# Altium project pca10156.PrjPCB (part 1 of 4)
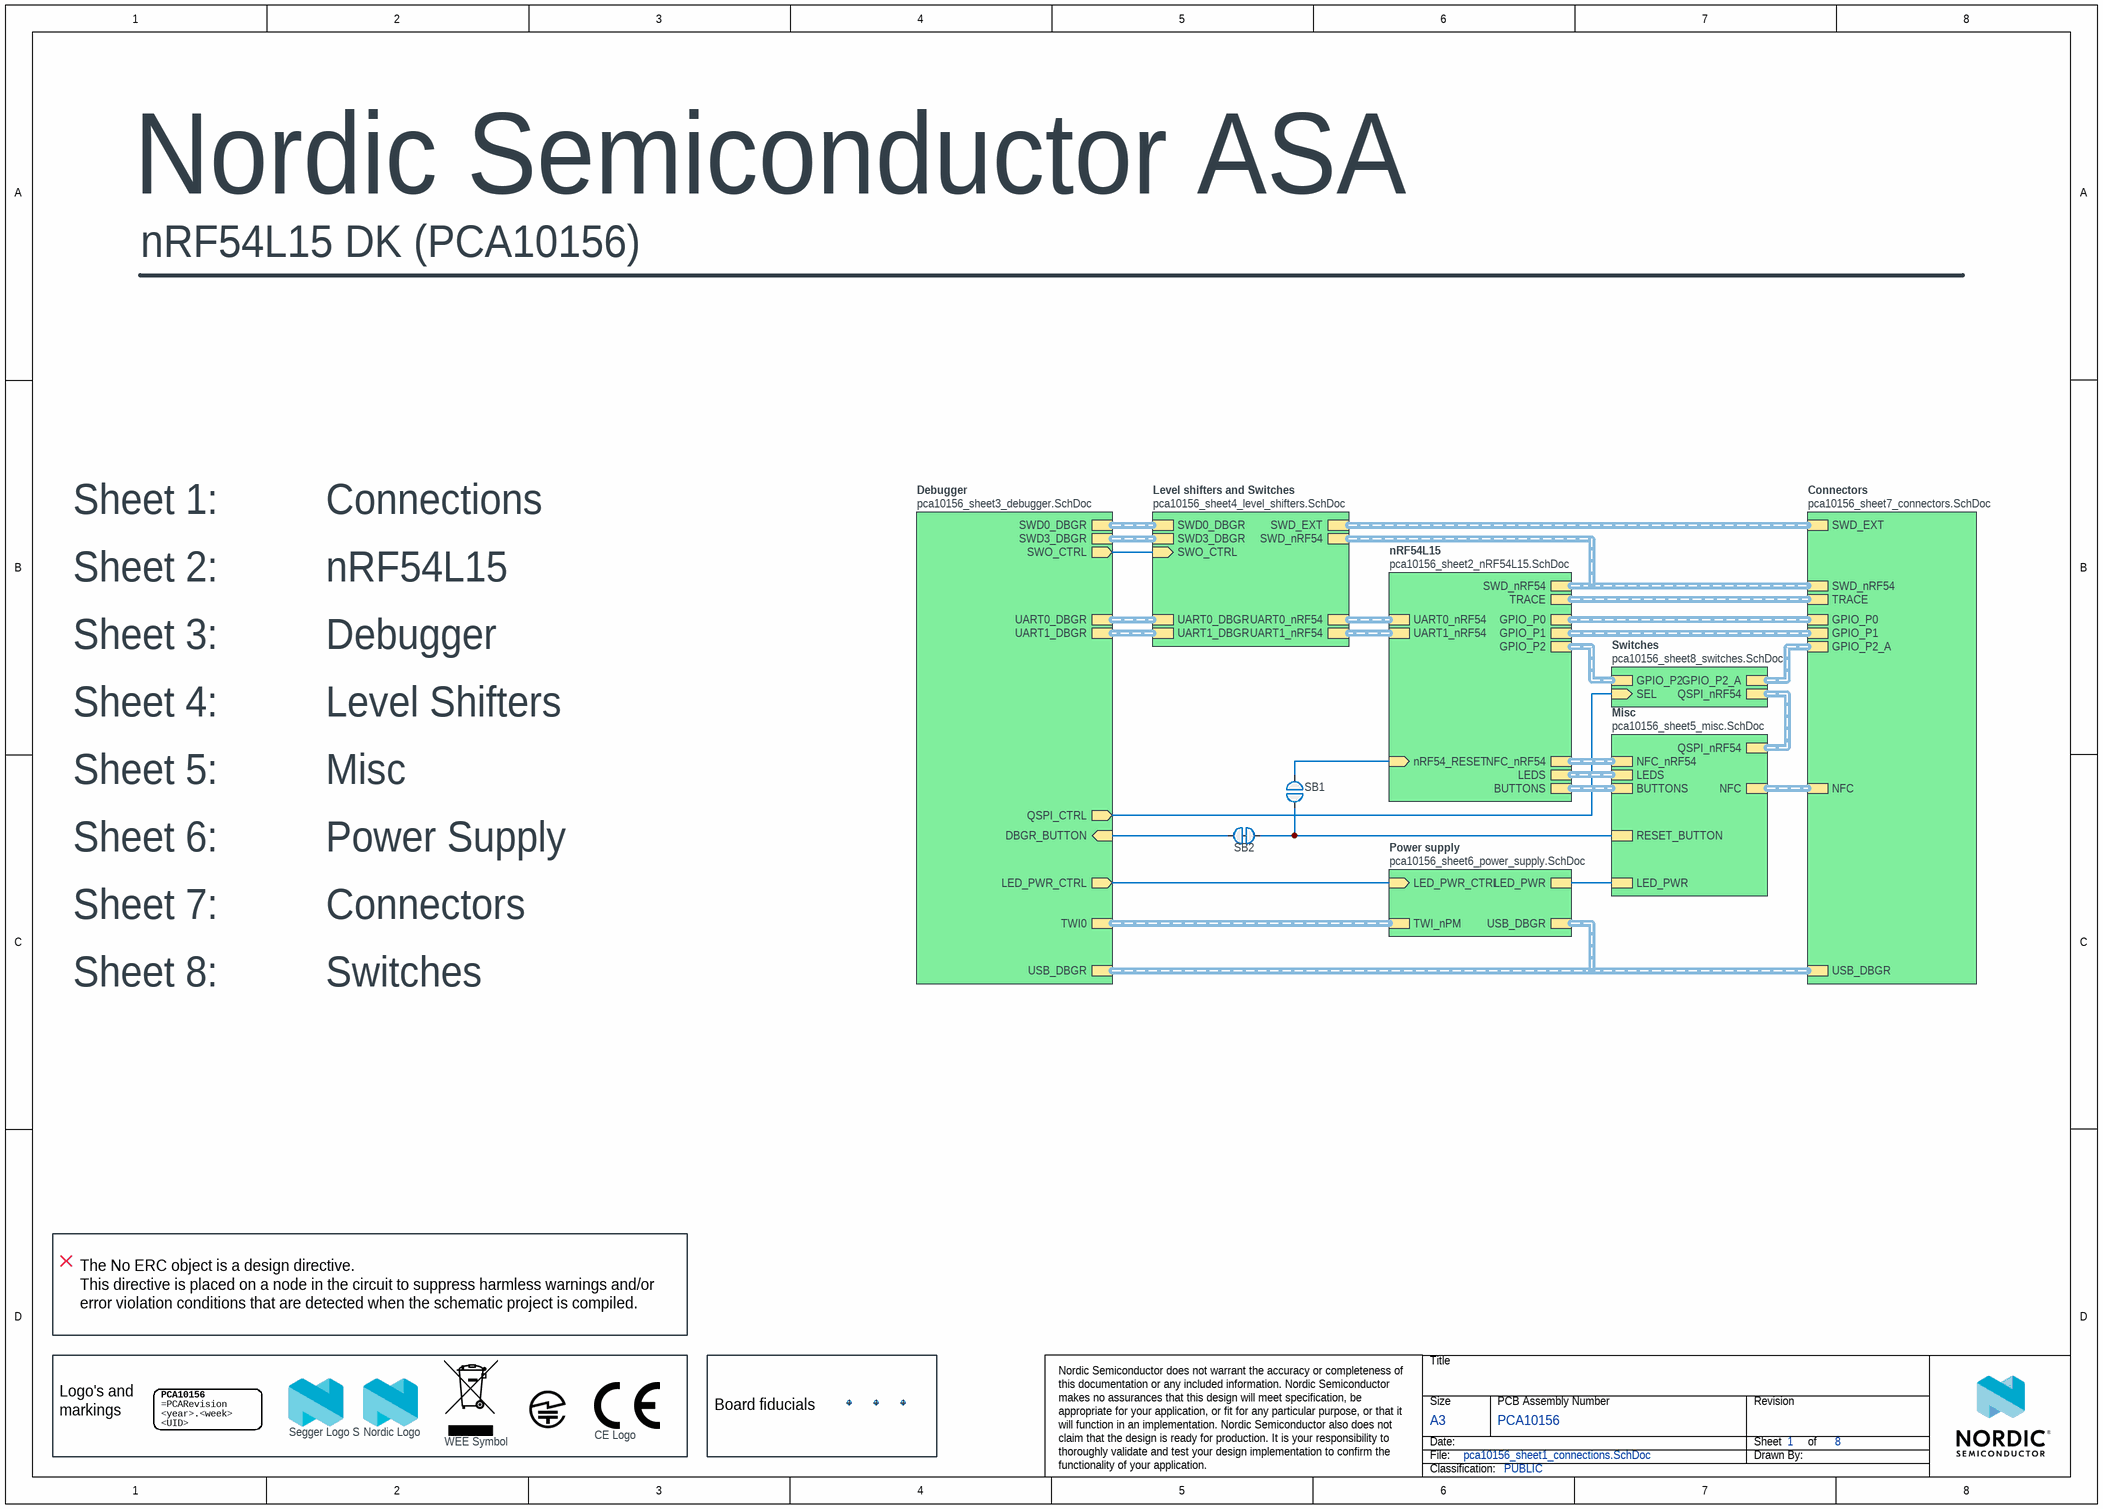
[diagram p0: pca10156_sheet1_connections.SchDoc]
BoardThickness: 1.6mm; BoardTitle: nRF54L15 DK; Classification: PUBLIC; Compliance: RoHS, REACH, Halogen-Free; Designer: STL1; Dielectric: FR-4; NrOfLayers: 4; Organization: Nordic Semiconductor; PCAName: PCA10156; PCARevision: 1.0.0; PCBNumber: 400708; PCBRevision: 0048STL1; PCBStackup: 4001; ProductName: nRF54L15 DK; SilkscreenColor: White; SoldermaskColor: Blue; SurfaceFinish: ENIG Gold
8 sheets, 226 parts. Net scope: hierarchical (ports join the sheet entries above them; power ports are global).
Board files: 400708.PcbDoc, 400708 _panel.PcbDoc
Sheets:
  pca10156_sheet1_connections.SchDoc
    nRF54L15 = pca10156_sheet2_nRF54L15.SchDoc
    Debugger = pca10156_sheet3_debugger.SchDoc
    Level shifters and Switches = pca10156_sheet4_level_shifters.SchDoc
    Misc = pca10156_sheet5_misc.SchDoc
    Power supply = pca10156_sheet6_power_supply.SchDoc
    Connectors = pca10156_sheet7_connectors.SchDoc
    Switches = pca10156_sheet8_switches.SchDoc

## Sheet pca10156_sheet1_connections.SchDoc: =BoardTitle+' - Connections'
size A3; Organization: Nordic Semiconductor; DocumentNumber: 1; Revision: 1.0.0; SheetNumber: 1; SheetTotal: 8; Author: STL1; CompanyName: Nordic Semiconductor; DrawnBy: STL1; DocumentSize: A4

### Parts
Fid1  Fiducial mark  [Fiducial]  (value not drawn)
Fid2  Fiducial mark  [Fiducial]  (value not drawn)
Fid3  Fiducial mark  [Fiducial]  (value not drawn)
LABEL1  12x12mm  [LabelSilk_12x12]  (value not drawn)
LOGO1  Nordic Logo  [NORDIC_LOGO_LYING]  (no BOM)
LOGO2  WEE Symbol  [WEE_3x4.5mm]  (no BOM)
LOGO3  Segger Logo S  [SEGGER_LOGO_S]  (no BOM)
LOGO4  CE Logo  [CE_logo]  (no BOM)
S1  Giteki Symbol  [Giteki]  (value not drawn)  (no BOM)
SB1  Solderbridge  [Solderbridge]  (value not drawn)  (no BOM)
SB2  Solderbridge  [Solderbridge_Shorted]  (value not drawn)  (net tie, no BOM)

### Sub-sheets
Connectors = pca10156_sheet7_connectors.SchDoc: SWD_nRF54 (harness SWD), TRACE (harness TRACE), NFC (harness NFC), SWD_EXT (harness SWD), GPIO_P0 (harness GPIO_P0), GPIO_P1 (harness GPIO_P1), USB_DBGR (harness USB), GPIO_P2_A (harness GPIO_P2)
Debugger = pca10156_sheet3_debugger.SchDoc: DBGR_BUTTON (in), SWD0_DBGR (harness SWD), UART0_DBGR (harness UART_DBGR), USB_DBGR (harness USB), UART1_DBGR (harness UART_DBGR), TWI0 (harness TWI), SWD3_DBGR (harness SWD), LED_PWR_CTRL (out), SWO_CTRL (out), QSPI_CTRL (out)
Level shifters and Switches = pca10156_sheet4_level_shifters.SchDoc: SWD0_DBGR (harness SWD), SWD_EXT (harness SWD), UART0_nRF54 (harness UART), UART1_nRF54 (harness UART), SWD3_DBGR (harness SWD), SWD_nRF54 (harness SWD), UART0_DBGR (harness UART_DBGR), UART1_DBGR (harness UART_DBGR), SWO_CTRL (in)
Misc = pca10156_sheet5_misc.SchDoc: NFC_nRF54 (harness NFC), NFC (harness NFC), BUTTONS (harness UI), LEDS (harness UI), RESET_BUTTON, LED_PWR, QSPI_nRF54
nRF54L15 = pca10156_sheet2_nRF54L15.SchDoc: BUTTONS (harness UI), LEDS (harness UI), TRACE (harness TRACE), NFC_nRF54 (harness NFC), GPIO_P0 (harness GPIO_P0), UART0_nRF54 (harness UART), GPIO_P1 (harness GPIO_P1), GPIO_P2 (harness GPIO_P2), UART1_nRF54 (harness UART), SWD_nRF54 (harness SWD), nRF54_RESET (in)
Power supply = pca10156_sheet6_power_supply.SchDoc: TWI_nPM (harness TWI), LED_PWR_CTRL (in), LED_PWR, USB_DBGR (harness USB)
Switches = pca10156_sheet8_switches.SchDoc: SEL (in), GPIO_P2 (harness GPIO_P2), QSPI_nRF54 (harness QSPI), GPIO_P2_A (harness GPIO_P2)

### Nets
DBGR_BUTTON: SB2.2 ; sheet Debugger/DBGR_BUTTON
LED_PWR_CTRL: sheet Debugger/LED_PWR_CTRL, sheet Power supply/LED_PWR_CTRL
nRF54_RESET: SB1.1 ; sheet nRF54L15/nRF54_RESET
QSPI_CTRL: sheet Debugger/QSPI_CTRL, sheet Switches/SEL
SWO_CTRL: sheet Debugger/SWO_CTRL, sheet Level shifters and Switches/SWO_CTRL
NetC64_2: sheet Misc/LED_PWR, sheet Power supply/LED_PWR
NetSB1_2: SB1.2 SB2.1 ; sheet Misc/RESET_BUTTON

### Buses and harness runs
harness sheet Connectors/GPIO_P0 = sheet nRF54L15/GPIO_P0
harness sheet Connectors/GPIO_P1 = sheet nRF54L15/GPIO_P1
harness sheet Connectors/GPIO_P2_A = sheet Switches/GPIO_P2_A
harness sheet Connectors/NFC = sheet Misc/NFC
harness sheet Connectors/SWD_EXT = sheet Level shifters and Switches/SWD_EXT
harness sheet Connectors/SWD_nRF54 = sheet Level shifters and Switches/SWD_nRF54 = sheet nRF54L15/SWD_nRF54
harness sheet Connectors/TRACE = sheet nRF54L15/TRACE
harness sheet Connectors/USB_DBGR = sheet Debugger/USB_DBGR = sheet Power supply/USB_DBGR
harness sheet Debugger/SWD0_DBGR = sheet Level shifters and Switches/SWD0_DBGR
harness sheet Debugger/SWD3_DBGR = sheet Level shifters and Switches/SWD3_DBGR
harness sheet Debugger/TWI0 = sheet Power supply/TWI_nPM
harness sheet Debugger/UART0_DBGR = sheet Level shifters and Switches/UART0_DBGR
harness sheet Debugger/UART1_DBGR = sheet Level shifters and Switches/UART1_DBGR
harness sheet Level shifters and Switches/UART0_nRF54 = sheet nRF54L15/UART0_nRF54
harness sheet Level shifters and Switches/UART1_nRF54 = sheet nRF54L15/UART1_nRF54
harness sheet Misc/BUTTONS = sheet nRF54L15/BUTTONS
harness sheet Misc/LEDS = sheet nRF54L15/LEDS
harness sheet Misc/NFC_nRF54 = sheet nRF54L15/NFC_nRF54
harness sheet Misc/QSPI_nRF54 = sheet Switches/QSPI_nRF54
harness sheet nRF54L15/GPIO_P2 = sheet Switches/GPIO_P2

### Notes on the sheet
- Sheet 1:          Connections
- Sheet 2:          nRF54L15
- Sheet 4:          Level Shifters
- Sheet 3:          Debugger
- Sheet 5:          Misc
- Sheet 6:          Power Supply
- Sheet 7:          Connectors
- Sheet 8:          Switches
- The No ERC object is a design directive.
  This directive is placed on a node in the circuit to suppress harmless warnings and/or error violation conditions that are detected when the schematic project is compiled.
- (near LABEL1) Logo's and markings
- (near Fid1) Board fiducials
- Nordic Semiconductor ASA
- Title
- Size
- Date:
- File:
- A3
- PCB Assembly Number
- Sheet
- Drawn By:
- Revision
- of
- Nordic Semiconductor does not warrant the accuracy or completeness of this documentation or any included information. Nordic Semiconductor makes no assurances that this design will meet specification, be appropriate for your application, or fit for any particular purpose, or that it will function in an implementation. Nordic Semiconductor also does not claim that the design is ready for production. It is your responsibility to thoroughly validate and test your design implementation to confirm the functionality of your application.
  © Nordic Semiconductor — All rights reserved.
- Classification:
- (in symbol Label_12x12) <year>.<week>; <UID>

### Library data of the parts
Fid1-Fid3 = Fid-Mark: Manufacturer: N.A.; Part number NEMS: 100500073; Value: N.A.; Pad Count: 1; Component Status: Active; System: Connector; Part Number: Fid-Mark; Manufacturer Part Number: N.A.; LatestRevisionDate: 2009-12-12; Published: 2009-12-12; Note: N.A.; Artikkelnr Noca: N.A.; Footprint Doc: Fiducial; Part number IPS: N.A.; ComponentLink1URL: N.A.; ComponentLink1Description: Datasheet; ComponentLink2URL: N.A.; ComponentLink2Description: Supplier link; HelpURL: N.A.; Supplier 1: N.A.; Supplier Part Number 1: N.A.; Supplier 2: N.A.; Supplier Part Number 2: N.A.; PartId: 100500073; Component Class: Connectors; Author: rsk; Part number Norautron: N.A.
LABEL1 = Label_12x12: PCA version label, stick-on, 12x12mm; Manufacturer: Ellco Etikett; Manufacturer Part Number: A33512‐01; Part number NEMS: 101200028; Component Status: Active; Pad Count: 0; Note: N.A.; Part Number: Label_12x12; PartId: 101200028; Component Class: Mechanicals; Author: hany; ComponentLink1URL: N.A.; ComponentLink1Description: Datasheet; ComponentLink2URL: N.A.; ComponentLink2Description: Supplier link; HelpURL: N.A.; LatestRevisionDate: 2023-01-05; Published: 2023-01-05; Footprint Doc: Label; Value: 12x12mm; Supplier 1: N.A.; Supplier Part Number 1: N.A.; Supplier 2: N.A.; Supplier Part Number 2: N.A.; Artikkelnr Noca: N.A.; Part number IPS: N.A.; Part number Norautron: N.A.
LOGO1 = Nordic Logo lying: Manufacturer: N.A.; Part number NEMS: 101100001; Component Status: Active; Pad Count: 0; Part Number: Nordic Logo lying; PartId: 101100001; Component Class: Markings; Author: rsk; Manufacturer Part Number: N.A.; ComponentLink1URL: N.A.; ComponentLink1Description: Datasheet; ComponentLink2URL: N.A.; ComponentLink2Description: Supplier link; HelpURL: N.A.; LatestRevisionDate: 2017-03-20; Published: 2017-09-01; Footprint Doc: Nordic Logo; Value: Nordic Logo; Note: N.A.; Supplier 1: N.A.; Supplier Part Number 1: N.A.; Supplier 2: N.A.; Supplier Part Number 2: N.A.; Artikkelnr Noca: N.A.; Part number IPS: N.A.; Part number Norautron: N.A.
LOGO2 = WEEE Symbol 3x4.5mm: WEEE Directive symbol; Manufacturer: N.A.; Part number NEMS: 101100006; Component Status: Active; Pad Count: 0; Part Number: WEEE Symbol 3x4.5mm; PartId: 101100006; Component Class: Markings; Author: rsk; Manufacturer Part Number: N.A.; ComponentLink1URL: N.A.; ComponentLink1Description: Datasheet; ComponentLink2URL: N.A.; ComponentLink2Description: Supplier link; HelpURL: N.A.; LatestRevisionDate: 2023-03-07; Published: 2016-09-07; Footprint Doc: WEE_3x4.5mm; Value: WEE Symbol; Note: N.A.; Supplier 1: N.A.; Supplier Part Number 1: N.A.; Supplier 2: N.A.; Supplier Part Number 2: N.A.; Artikkelnr Noca: N.A.; Part number IPS: N.A.; Part number Norautron: N.A.
LOGO3 = Segger Logo S: Segger logo, small size; Manufacturer: N.A.; Part number NEMS: 101100004; Component Status: Active; Pad Count: 0; Part Number: Segger Logo S; PartId: 101100004; Component Class: Markings; Author: rsk; Manufacturer Part Number: N.A.; ComponentLink1URL: N.A.; ComponentLink1Description: Datasheet; ComponentLink2URL: N.A.; ComponentLink2Description: Supplier link; HelpURL: N.A.; LatestRevisionDate: 2016-09-07; Published: 2016-09-07; Footprint Doc: Segger Logo S; Value: Segger Logo S; Note: N.A.; Supplier 1: N.A.; Supplier Part Number 1: N.A.; Supplier 2: N.A.; Supplier Part Number 2: N.A.; Artikkelnr Noca: N.A.; Part number IPS: N.A.; Part number Norautron: N.A.
LOGO4 = CE_logo: CE (Conformité_Européenne) logo; Manufacturer: N.A.; Part number NEMS: 101100010; Component Status: Active; Pad Count: 0; Part Number: CE_logo; PartId: 101100010; Component Class: Markings; Author: daba; Manufacturer Part Number: N.A.; ComponentLink1URL: N.A.; ComponentLink1Description: Datasheet; ComponentLink2URL: N.A.; ComponentLink2Description: Supplier link; HelpURL: N.A.; LatestRevisionDate: 2024-11-26; Published: 2024-11-26; Footprint Doc: CE_logo; Value: CE Logo; Note: N.A.; Supplier 1: N.A.; Supplier Part Number 1: N.A.; Supplier 2: N.A.; Supplier Part Number 2: N.A.; Artikkelnr Noca: N.A.; Part number IPS: N.A.; Part number Norautron: N.A.
S1 = Giteki Symbol: Manufacturer: N.A.; Part number NEMS: 101100011; Component Status: Active; Pad Count: 0; Part Number: Giteki Symbol; PartId: 101100011; Component Class: Markings; Author: getr; Manufacturer Part Number: N.A.; ComponentLink1URL: N.A.; ComponentLink1Description: Datasheet; ComponentLink2URL: N.A.; ComponentLink2Description: Supplier link; HelpURL: N.A.; LatestRevisionDate: 2025-02-28; Published: 2025-02-28; Footprint Doc: Giteki Symbol; Value: Giteki Symbol; Note: N.A.; Supplier 1: N.A.; Supplier Part Number 1: N.A.; Supplier 2: N.A.; Supplier Part Number 2: N.A.; Artikkelnr Noca: N.A.; Part number IPS: N.A.; Part number Norautron: N.A.
SB1 = Solderbridge: Manufacturer: N.A.; Part number NEMS: 100500458; Pad Count: 2; Component Status: Active; System: Connector; Part Number: Solderbridge; Manufacturer Part Number: N.A.; LatestRevisionDate: 2009-12-14; Published: 2009-12-14; Value: Solderbridge; Note: N.A.; Artikkelnr Noca: N.A.; Footprint Doc: Solderbridge; Part number IPS: N.A.; ComponentLink1URL: N.A.; ComponentLink1Description: Datasheet; ComponentLink2URL: N.A.; ComponentLink2Description: Supplier link; HelpURL: N.A.; Supplier 1: N.A.; Supplier Part Number 1: N.A.; Supplier 2: N.A.; Supplier Part Number 2: N.A.; Component Class: Connectors; PartId: 100500458; Author: rsk; Part number Norautron: N.A.
SB2 = Solderbridge Shorted: Shorted Solderbridge; Manufacturer: N.A.; Part number NEMS: 100500459; Pad Count: 2; Component Status: Active; System: Connector; Part Number: Solderbridge Shorted; Manufacturer Part Number: N.A.; LatestRevisionDate: 2012-08-07; Published: 2012-08-07; Value: Solderbridge; Note: N.A.; Artikkelnr Noca: N.A.; Footprint Doc: Solderbridge_Shorted; Part number IPS: N.A.; ComponentLink1URL: N.A.; ComponentLink1Description: Datasheet; ComponentLink2URL: N.A.; ComponentLink2Description: Supplier link; HelpURL: N.A.; Supplier 1: N.A.; Supplier Part Number 1: N.A.; Supplier 2: N.A.; Supplier Part Number 2: N.A.; Component Class: Connectors; PartId: 100500459; Author: rsk; Part number Norautron: N.A.

## Sheet pca10156_sheet2_nRF54L15.SchDoc: =BoardTitle+' - nRF54L15'
size A3; Organization: Nordic Semiconductor; DocumentNumber: 2; Revision: 1.0.0; SheetNumber: 2; SheetTotal: 8; Author: STL1; CompanyName: Nordic Semiconductor; DrawnBy: STL1; DocumentSize: A4
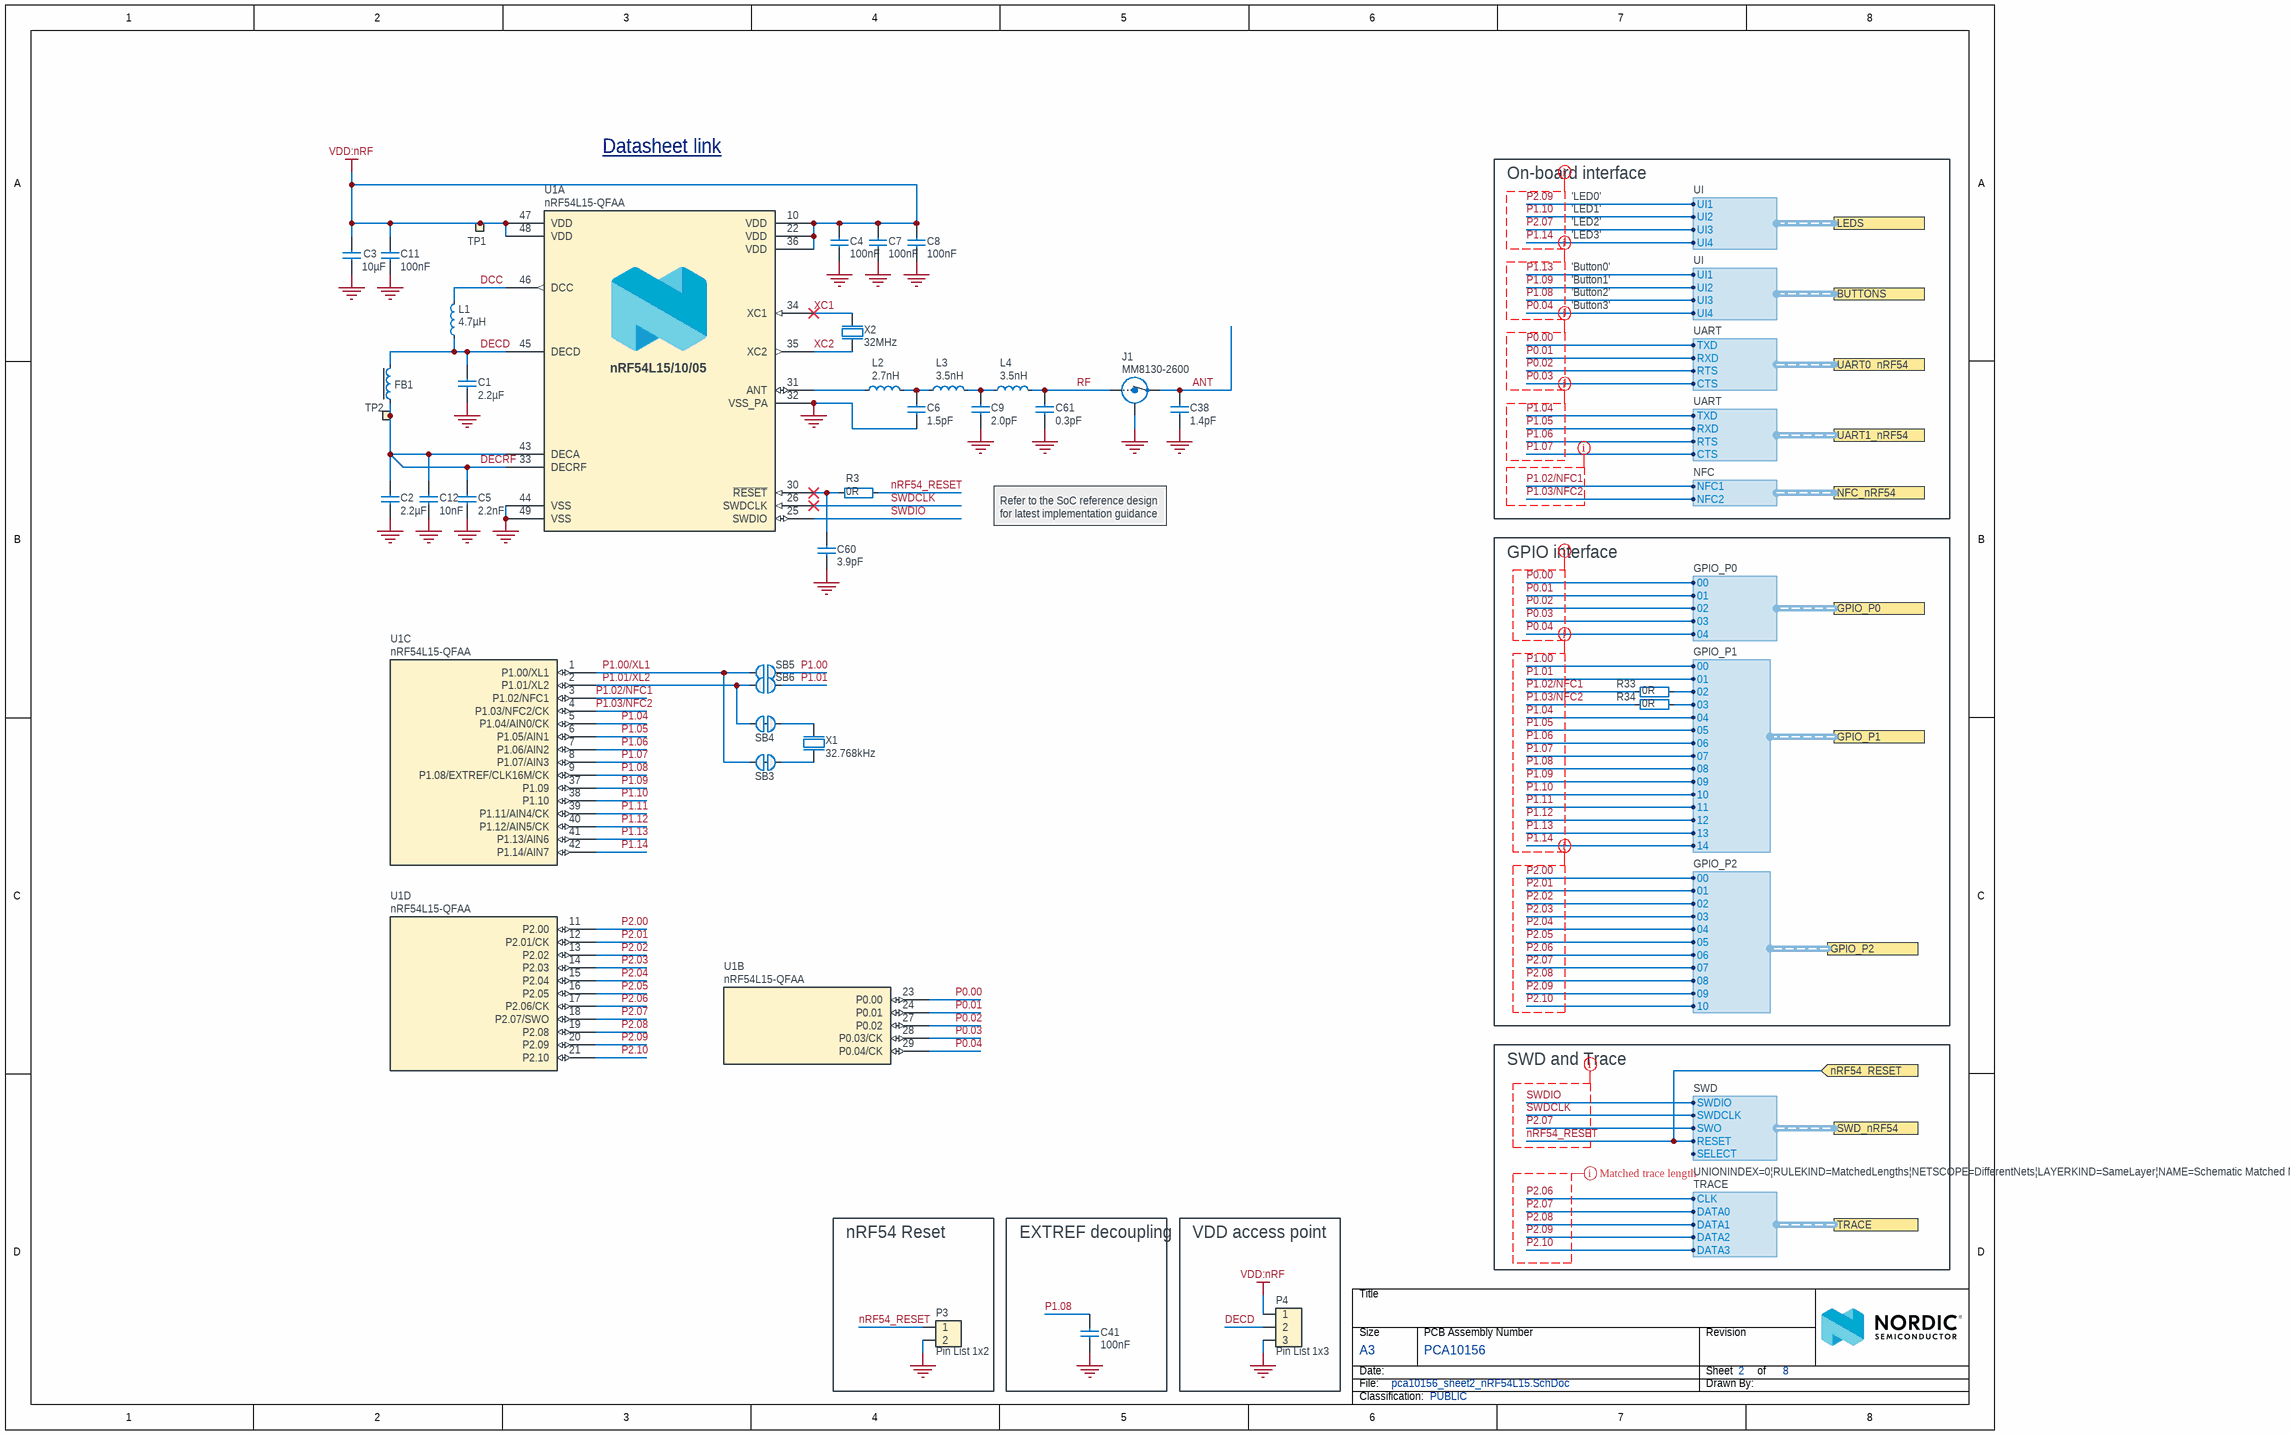
[diagram p1: pca10156_sheet2_nRF54L15.SchDoc]

### Parts
C1  2.2µF  [CAPC0603X03L_C]
C2  2.2µF  [CAPC0603X03L_C]
C3  10µF  [CAPC1005X04L]
C4  100nF  [CAPC0603X03L_C]
C5  2.2nF  [CAPC0603X03L_C]
C6  1.5pF  [CAPC0603X03L_C]
C7  100nF  [CAPC0603X03L_C]
C8  100nF  [CAPC0603X03L_C]
C9  2.0pF  [CAPC0603X03L_C]
C11  100nF  [CAPC0603X03L_C]
C12  10nF  [CAPC0603X03L_C]
C38  1.4pF  [CAPC0603X03L_C]
C41  100nF  [CAPC1005X04L]
C60  3.9pF  [CAPC0603X03L_C]
C61  0.3pF  [CAPC0603X03L_C]
FB1  120R/0.2A  [INDC0603X03L_C]  (value not drawn)
J1  MM8130-2600  [COAXIAL-SWF]
L1  4.7µH  [INDC1608X06L]
L2  2.7nH  [INDC0603X03L_C]
L3  3.5nH  [INDC0603X03L_C]
L4  3.5nH  [INDC0603X03L_C]
P3  Pin List 1x2  [LIST_1x2]
P4  Pin List 1x3  [LIST_1x3]
R3  0R  [RESC0603X03L_C]
R33  0R  [RESC1005X04L]
R34  0R  [RESC1005X04L]
SB3  Solderbridge  [Solderbridge_SHORTED_0.4]  (value not drawn)  (net tie, no BOM)
SB4  Solderbridge  [Solderbridge_SHORTED_0.4]  (value not drawn)  (net tie, no BOM)
SB5  Solderbridge  [Solderbridge_0.4]  (value not drawn)  (no BOM)
SB6  Solderbridge  [Solderbridge_0.4]  (value not drawn)  (no BOM)
TP1  Ø1.5mm,SMD  [TP_SMD_D1.5mm]  (value not drawn)  (no BOM)
TP2  Ø1.5mm,SMD  [TP_SMD_D1.5mm]  (value not drawn)  (no BOM)
U1  nRF54L15-QFAA  [QFN40P600X600X90-48N]  (parts A,B,C,D of 4)
X1  32.768kHz  [XTAL_2012]
X2  32MHz  [BT-XTAL_2016]

### Blocks framed on the sheet
GPIO interface: R33 R34
nRF54 Reset: P3
EXTREF decoupling: C41
VDD access point: P4

### Ports
BUTTONS (harness UI), GPIO_P0 (harness GPIO_P0), GPIO_P1 (harness GPIO_P1), GPIO_P2 (harness GPIO_P2), LEDS (harness UI), NFC_nRF54 (harness NFC), nRF54_RESET (in), SWD_nRF54 (harness SWD), TRACE (harness TRACE), UART0_nRF54 (harness UART), UART1_nRF54 (harness UART)

### Harnesses
SWD: SWDIO, SWDCLK, SWO, RESET, SELECT
NFC: NFC2, NFC1
UART: RTS, CTS, RXD, TXD
GPIO_P1: 00, 01, 02, 03, 04, 05, 06, 07, 08, 09, 10, 11, 12, 13, 14
GPIO_P0: 02, 03, 04, 00, 01
TRACE: CLK, DATA0, DATA1, DATA3, DATA2
UI: UI2, UI1, UI3, UI4
GPIO_P2: 00, 01, 02, 03, 04, 05, 06, 07, 08, 09, 10

### Nets
GND: C1.1 C2.1 C3.1 C4.2 C5.1 C6.1 C7.2 C8.2 C9.1 C11.2 C12.2 C38.1 C41.1 C60.2 C61.1 J1.2(Shield) P3.2 P4.3 U1.32(VSS_PA) U1.44(VSS) U1.49(VSS) X2.2(GND) X2.4(GND)
VDD:nRF: C3.2 C4.1 C7.1 C8.1 C11.1 P4.1 TP1.1 U1.10(VDD) U1.22(VDD) U1.36(VDD) U1.47(VDD) U1.48(VDD)
ANT: C38.2 J1.3(OUT)
DCC: L1.2 U1.46(DCC)
DECD: C1.2 FB1.1 L1.1 P4.2 U1.45(DECD)
DECRF: C2.2 C5.2 C12.1 FB1.2 TP2.1 U1.33(DECRF) U1.43(DECA)
nRF54_RESET: P3.1 R3.2 ; port nRF54_RESET, port SWD_nRF54.RESET
P0.00: U1.23(P0.00) ; port UART0_nRF54.TXD, port GPIO_P0.00
P0.01: U1.24(P0.01) ; port UART0_nRF54.RXD, port GPIO_P0.01
P0.02: U1.27(P0.02) ; port UART0_nRF54.RTS, port GPIO_P0.02
P0.03: U1.28(P0.03/CK) ; port UART0_nRF54.CTS, port GPIO_P0.03
P0.04: U1.29(P0.04/CK) ; port GPIO_P0.04, port BUTTONS.UI4
P1.00: SB5.2 ; port GPIO_P1.00
P1.00/XL1: SB3.1 SB5.1 U1.1(P1.00/XL1)
P1.01: SB6.2 ; port GPIO_P1.01
P1.01/XL2: SB4.1 SB6.1 U1.2(P1.01/XL2)
P1.02/NFC1: R33.1 U1.3(P1.02/NFC1) ; port NFC_nRF54.NFC1
P1.03/NFC2: R34.1 U1.4(P1.03/NFC2/CK) ; port NFC_nRF54.NFC2
P1.04: U1.5(P1.04/AIN0/CK) ; port GPIO_P1.04, port UART1_nRF54.TXD
P1.05: U1.6(P1.05/AIN1) ; port GPIO_P1.05, port UART1_nRF54.RXD
P1.06: U1.7(P1.06/AIN2) ; port GPIO_P1.06, port UART1_nRF54.RTS
P1.07: U1.8(P1.07/AIN3) ; port GPIO_P1.07, port UART1_nRF54.CTS
P1.08: C41.2 U1.9(P1.08/EXTREF/CLK16M/CK) ; port GPIO_P1.08, port BUTTONS.UI3
P1.09: U1.37(P1.09) ; port GPIO_P1.09, port BUTTONS.UI2
P1.10: U1.38(P1.10) ; port GPIO_P1.10, port LEDS.UI2
P1.11: U1.39(P1.11/AIN4/CK) ; port GPIO_P1.11
P1.12: U1.40(P1.12/AIN5/CK) ; port GPIO_P1.12
P1.13: U1.41(P1.13/AIN6) ; port GPIO_P1.13, port BUTTONS.UI1
P1.14: U1.42(P1.14/AIN7) ; port GPIO_P1.14, port LEDS.UI4
P2.00: U1.11(P2.00) ; port GPIO_P2.00
P2.01: U1.12(P2.01/CK) ; port GPIO_P2.01
P2.02: U1.13(P2.02) ; port GPIO_P2.02
P2.03: U1.14(P2.03) ; port GPIO_P2.03
P2.04: U1.15(P2.04) ; port GPIO_P2.04
P2.05: U1.16(P2.05) ; port GPIO_P2.05
P2.06: U1.17(P2.06/CK) ; port TRACE.CLK, port GPIO_P2.06
P2.07: U1.18(P2.07/SWO) ; port SWD_nRF54.SWO, port TRACE.DATA0, port LEDS.UI3, port GPIO_P2.07
P2.08: U1.19(P2.08) ; port TRACE.DATA1, port GPIO_P2.08
P2.09: U1.20(P2.09) ; port TRACE.DATA2, port LEDS.UI1, port GPIO_P2.09
P2.10: U1.21(P2.10) ; port TRACE.DATA3, port GPIO_P2.10
RF: C61.2 J1.1(IN) L4.2
SWDCLK: U1.26(SWDCLK) ; port SWD_nRF54.SWDCLK
SWDIO: U1.25(SWDIO) ; port SWD_nRF54.SWDIO
XC1: U1.34(XC1) X2.1(inp)
XC2: U1.35(XC2) X2.3(out)
NetC6_2: C6.2 L2.2 L3.1
NetC9_2: C9.2 L3.2 L4.1
NetC60_1: C60.1 R3.1 U1.30(~{RESET})
NetL2_1: L2.1 U1.31(ANT)
NetP1_5: R33.2 ; port GPIO_P1.02
NetP1_6: R34.2 ; port GPIO_P1.03
NetSB3_2: SB3.2 X1.2(out)
NetSB4_2: SB4.2 X1.1(inp)

### Layout directives
net class TRACE; rule Matched Net Lengths [Delay Tolerance = 500ps]: P2.06, P2.07, P2.08, P2.09, P2.10
net class UART0: P0.00, P0.01, P0.02, P0.03
net class UART1: P1.04, P1.05, P1.06, P1.07
net class LEDS: P1.10, P1.14, P2.07, P2.09
net class BUTTONS: P0.04, P1.08, P1.09, P1.13
net class GPIO_P0: P0.00, P0.01, P0.02, P0.03, P0.04
net class GPIO_P1: P1.00, P1.01, P1.02/NFC1, P1.03/NFC2, P1.04, P1.05, P1.06, P1.07, P1.08, P1.09, P1.10, P1.11, P1.12, P1.13, P1.14
net class GPIO_P2: P2.00, P2.01, P2.02, P2.03, P2.04, P2.05, P2.06, P2.07, P2.08, P2.09, P2.10
net class NFC: P1.02/NFC1, P1.03/NFC2
net class SWD_nRF54: nRF54_RESET, P2.07, SWDCLK, SWDIO

### Notes on the sheet
- Datasheet link <https://www.nordicsemi.com/nRF54L15 >
- On-board interface
- 'LED1'
- 'LED2'
- 'LED0'
- 'LED3'
- 'Button1'
- 'Button2'
- 'Button0'
- 'Button3'
- Refer to the SoC reference design for latest implementation guidance
- SWD and Trace
- Title
- Size
- Date:
- File:
- A3
- PCB Assembly Number
- Sheet
- Drawn By:
- Revision
- of
- Classification:
- (in symbol nRF54L15-QFAAC00, part A) nRF54L15/10/05

### Library data of the parts
C1 C2 = C0201-2µ2-2.5V-X6T-GRM033D80E225ME47D: Capacitor, Ceramic, 2.2µF 2.5V X6T 0201,±20%; Manufacturer: Murata; Manufacturer Part Number: GRM033R61A225KE47; Part number NEMS: 100200527; Component Status: Active; Pad Count: 2; Note: 2.5V, 20%, X6T; Artikkelnr Noca: N.A.; Part Number: C0201-2µ2-2.5V-X6T-GRM033D80E225ME47D; Component Class: Capacitors; Author: stl1; ComponentLink1URL: https://www.murata.com/products/productdetail?partno=GRM033D80E225ME47%23; ComponentLink1Description: Datasheet; ComponentLink2URL: N.A.; ComponentLink2Description: Supplier link; HelpURL: N.A.; LatestRevisionDate: 2022-02-27; Published: 2022-02-27; Footprint Doc: 0201; Value: 2.2µF; Supplier 1: Mouser; Supplier Part Number 1: 81-GRM033D80E225ME7D; Supplier 2: Digi-Key; Supplier Part Number 2: 490-18653-1-ND; Part number IPS: N.A.; Part number Norautron: N.A.; PartId: 100200527
C3 = C0402-10µF-6.3V-X6S: Capacitor, X6S, ±20%, 6.3V; Manufacturer: N.A.; Part number NEMS: 100200478; Component Status: Active; Pad Count: 2; Part Number: C0402-10µF-6.3V-X6S; PartId: 100200478; Component Class: Capacitors; Author: getr; Manufacturer Part Number: N.A.; ComponentLink1URL: N.A.; ComponentLink1Description: Datasheet; ComponentLink2URL: N.A.; ComponentLink2Description: Supplier link; HelpURL: N.A.; LatestRevisionDate: 2021-06-25; Published: 2021-06-25; Footprint Doc: 0402; Value: 10µF; Note: 6.3V; Supplier 1: N.A.; Supplier Part Number 1: N.A.; Supplier 2: N.A.; Supplier Part Number 2: N.A.; Artikkelnr Noca: N.A.; Part number IPS: N.A.; Part number Norautron: N.A.
C4 C7 C8 C11 = C0201-100n: Capacitor, X5R, ±10%; Manufacturer: N.A.; Part number IPS: 00000001248, 00000002505; Part number Norautron: 262071862; Part number NEMS: 100200078; Pad Count: 2; Note: 16V; Component Status: Active; Part Number: C0201-100n; LatestRevisionDate: 2017-11-09; Published: 2014-11-13; Value: 100nF; Footprint Doc: 0201; Component Class: Capacitors; PartId: 100200078; Author: rsk; Manufacturer Part Number: N.A.; ComponentLink1URL: N.A.; ComponentLink1Description: Datasheet; ComponentLink2URL: N.A.; ComponentLink2Description: Supplier link; HelpURL: N.A.; Supplier 1: N.A.; Supplier Part Number 1: N.A.; Supplier 2: N.A.; Supplier Part Number 2: N.A.; Artikkelnr Noca: N.A.
C5 = C0201-2n2: Capacitor, X7R, ±10%, 10V; Manufacturer: N.A.; Part number IPS: 00000001778; Part number Norautron: 26470002; Part number NEMS: 100200060; Component Status: Active; Pad Count: 2; Part Number: C0201-2n2; PartId: 100200060; Component Class: Capacitors; Author: rsk; Manufacturer Part Number: N.A.; ComponentLink1URL: N.A.; ComponentLink1Description: Datasheet; ComponentLink2URL: N.A.; ComponentLink2Description: Supplier link; HelpURL: N.A.; LatestRevisionDate: 2014-11-13; Published: 2014-11-13; Footprint Doc: 0201; Value: 2.2nF; Note: 10V; Supplier 1: N.A.; Supplier Part Number 1: N.A.; Supplier 2: N.A.; Supplier Part Number 2: N.A.; Artikkelnr Noca: N.A.
C6 = C0201-1.5p-25V-NP0-GJM0335C1E1R5WB01: Capacitor, NP0, ±0.05pF, 25V, High Q; Manufacturer: Murata; Part number NEMS: 100200477; Component Status: Active; Pad Count: 2; Artikkelnr Noca: N.A.; Part Number: C0201-1.5p-25V-NP0-GJM0335C1E1R5WB01; PartId: 100200477; Component Class: Capacitors; Author: masi; Manufacturer Part Number: GJM0335C1E1R5WB01; ComponentLink1URL: https://search.murata.co.jp/Ceramy/image/img/A01X/G101/ENG/GJM0335C1E1R5WB01-01.pdf; ComponentLink1Description: Datasheet; ComponentLink2URL: N.A.; ComponentLink2Description: Supplier link; HelpURL: https://www.murata.com/products/productdetail?partno=GJM0335C1E1R5WB01%23; LatestRevisionDate: 2021-06-15; Published: 2021-06-15; Footprint Doc: 0201; Value: 1.5pF; Note: 25V; Supplier 1: Digi-Key; Supplier Part Number 1: 490-11176-2-ND; Supplier 2: Mouser; Supplier Part Number 2: 81-GJM0335C1E1R5WB1D; Part number IPS: N.A.; Part number Norautron: N.A.
C9 = C0201-2.0p-HQ-Murata: Capacitor, NP0, ±0.05pF, 25V; Manufacturer: Murata; Manufacturer Part Number: GJM0335C1E2R0WB01; Part number IPS: 00000001775; Part number NEMS: 100200419; Component Status: Active; Pad Count: 2; Artikkelnr Noca: N.A.; Part Number: C0201-2.0p-HQ-Murata; PartId: 100200419; Component Class: Capacitors; Author: rsk; ComponentLink1URL: N.A.; ComponentLink1Description: Datasheet; ComponentLink2URL: N.A.; ComponentLink2Description: Supplier link; HelpURL: https://psearch.en.murata.com/capacitor/product/GJM0335C1E2R0WB01%23.html; LatestRevisionDate: 2018-10-25; Published: 2018-10-25; Footprint Doc: 0201; Value: 2.0pF; Note: 25V; Supplier 1: N.A.; Supplier Part Number 1: N.A.; Supplier 2: N.A.; Supplier Part Number 2: N.A.; Part number Norautron: N.A.
C12 = C0201-10n: Capacitor, X7R, ±10%; Manufacturer: N.A.; Part number IPS: 00000003480; Part number Norautron: 26621779; Part number NEMS: 100200067; Note: 10V; Pad Count: 2; Component Status: Active; Part Number: C0201-10n; Manufacturer Part Number: N.A.; LatestRevisionDate: 2017-11-09; Published: 2014-11-13; Value: 10nF; Artikkelnr Noca: N.A.; Footprint Doc: 0201; ComponentLink1URL: N.A.; ComponentLink1Description: Datasheet; ComponentLink2URL: N.A.; ComponentLink2Description: Supplier link; HelpURL: N.A.; Supplier 1: N.A.; Supplier Part Number 1: N.A.; Supplier 2: N.A.; Supplier Part Number 2: N.A.; Component Class: Capacitors; PartId: 100200067; Author: rsk
C38 = C0201-1.4p-25V-GJM0335C1E1R4WB01D: Capacitor, C0G, ±0.05pF, 25V; Manufacturer: Murata; Part number NEMS: 100200553; Pad Count: 2; Artikkelnr Noca: N.A.; Component Status: Active; Part Number: C0201-1.4p-25V-GJM0335C1E1R4WB01D; PartId: 100200553; Component Class: Capacitors; Author: stl1; Manufacturer Part Number: GJM0335C1E1R4WB01D; ComponentLink1URL: https://www.murata.com/products/productdetail?partno=GJM0335C1E1R4WB01%23; ComponentLink1Description: Datasheet; ComponentLink2URL: N.A.; ComponentLink2Description: Supplier link; HelpURL: N.A.; Footprint Doc: 0201; LatestRevisionDate: 2023-05-30; Published: 2023-05-30; Value: 1.4pF; Note: 25V; Supplier 1: Digi-Key; Supplier Part Number 1: 490-GJM0335C1E1R4WB01DTR-ND; Supplier 2: Mouser; Supplier Part Number 2: 81-GJM0335C1E1R4WB1D; Part number IPS: N.A.; Part number Norautron: N.A.
C41 = C0402-100n: Capacitor, X7R, ±10%; Manufacturer: N.A.; Part number IPS: 00000005296; Part number NEMS: 100200184; Component Status: Active; Pad Count: 2; Note: 16V; Artikkelnr Noca: 20039200; Part Number: C0402-100n; PartId: 100200184; Component Class: Capacitors; Author: rsk; Manufacturer Part Number: N.A.; ComponentLink1URL: N.A.; ComponentLink1Description: Datasheet; ComponentLink2URL: N.A.; ComponentLink2Description: Supplier link; HelpURL: N.A.; LatestRevisionDate: 2009-11-23; Published: 2009-05-08; Footprint Doc: 0402; Value: 100nF; Supplier 1: N.A.; Supplier Part Number 1: N.A.; Supplier 2: N.A.; Supplier Part Number 2: N.A.; Part number Norautron: N.A.
C60 = C0201-3.9p-HQ-Murata: Capacitor, NP0, ±0.05pF, 25V; Manufacturer: Murata; Manufacturer Part Number: GJM0333C1E3R9WB01; Part number NEMS: 100200424; Component Status: Active; Pad Count: 2; Artikkelnr Noca: N.A.; Part Number: C0201-3.9p-HQ-Murata; PartId: 100200424; Component Class: Capacitors; Author: rsk; ComponentLink1URL: N.A.; ComponentLink1Description: Datasheet; ComponentLink2URL: N.A.; ComponentLink2Description: Supplier link; HelpURL: https://psearch.en.murata.com/capacitor/product/GJM0333C1E3R9WB01%23.html; LatestRevisionDate: 2019-03-27; Published: 2019-03-27; Footprint Doc: 0201; Value: 3.9pF; Note: 25V; Supplier 1: N.A.; Supplier Part Number 1: N.A.; Supplier 2: N.A.; Supplier Part Number 2: N.A.; Part number IPS: N.A.; Part number Norautron: N.A.
C61 = C0201-0.3p-50V-GRM0335C1HR30BA01: Capacitor, C0G, ±0.1pF, 50V; Manufacturer: Murata; Part number NEMS: 100200650; Component Status: Active; Pad Count: 2; Artikkelnr Noca: N.A.; Part Number: C0201-0.3p-50V-GRM0335C1HR30BA01; PartId: 100200650; Component Class: Capacitors; Author: masi; Manufacturer Part Number: GRM0335C1HR30BA01; ComponentLink1URL: https://www.murata.com/en-global/products/productdetail?partno=GRM0335C1HR30BA01%23; ComponentLink1Description: Datasheet; ComponentLink2URL: N.A.; ComponentLink2Description: Supplier link; HelpURL: N.A.; LatestRevisionDate: 2024-01-10; Published: 2024-01-10; Footprint Doc: 0201; Value: 0.3pF; Note: 50V; Supplier 1: Digi-Key; Supplier Part Number 1: 490-6135-2-ND; Supplier 2: Mouser; Supplier Part Number 2: 81-GRM0335C1HR30BA1D; Part number IPS: N.A.; Part number Norautron: N.A.
FB1 = FB0201-120R@100M-200mA-BLM03AG121SN1D: Ferrite Bead, 120 Ohm @ 100MHz, 200mA, 500 mOhm Max; Manufacturer: Murata; Part number NEMS: 100300419; Component Status: Active; Pad Count: 2; Artikkelnr Noca: N.A.; Part Number: FB0201-120R@100M-200mA-BLM03AG121SN1D; Component Class: Inductors; Author: stl1; Manufacturer Part Number: BLM03AG121SN1D; ComponentLink1URL: https://www.murata.com/en-eu/products/productdetail?partno=BLM03AG121SN1%23; ComponentLink1Description: Datasheet; ComponentLink2URL: N.A.; ComponentLink2Description: Supplier link; HelpURL: N.A.; LatestRevisionDate: 2022-02-27; Published: 2022-02-27; Footprint Doc: 0201; Value: 120R/0.2A; Note: Ferrite Bead; Supplier 1: Digi-Key; Supplier Part Number 1: 490-5622-1-ND; Supplier 2: Mouser; Supplier Part Number 2: 81-BLM03AX121SN1D; Part number IPS: N.A.; Part number Norautron: N.A.; PartId: 100300419
J1 = MM8130-2600: Coaxial Connector with Switch; Manufacturer: Murata; Part number IPS: 00000009955; Part number Norautron: 26030338; Part number NEMS: 100500400; Component Status: Active; Pad Count: 3; Note: N.A.; Artikkelnr Noca: 55029011; Part Number: MM8130-2600; PartId: 100500400; Component Class: Connectors; Author: rsk; Manufacturer Part Number: MM8130-2600; ComponentLink1URL: N.A.; ComponentLink1Description: Datasheet; ComponentLink2URL: N.A.; ComponentLink2Description: Supplier link; HelpURL: http://www.murata.com/products/catalog/pdf/o33e.pdf; LatestRevisionDate: 2014-04-24; Published: 2014-04-24; Footprint Doc: COAXIAL-SWF; Value: MM8130-2600; Supplier 1: Digi-Key; Supplier Part Number 1: 490-4981-1-ND; Supplier 2: Mouser; Supplier Part Number 2: 81-MM8130-2600RA2; System: Connector
L1 = L0603-4µ7-MLZ1608M4R7WT000: Inductor, 120mA, ±20%, 0.65R; Manufacturer: TDK Corporation; Part number NEMS: 100300440; Component Status: Active; Pad Count: 2; Note: Power Inductor ±20%; Artikkelnr Noca: N.A.; Part Number: L0603-4µ7-MLZ1608M4R7WT000; PartId: 100300440; Component Class: Inductors; Author: stl1; Manufacturer Part Number: MLZ1608M4R7WT000; ComponentLink1URL: https://product.tdk.com/en/search/inductor/inductor/smd/info?part_no=MLZ1608M4R7WT000; ComponentLink1Description: Datasheet; ComponentLink2URL: N.A.; ComponentLink2Description: Supplier link; HelpURL: N.A.; LatestRevisionDate: 2023-05-10; Published: 2023-05-10; Footprint Doc: 0603; Value: 4.7µH; Supplier 1: Digi-Key; Supplier Part Number 1: 445-6390-2-ND; Supplier 2: Mouser; Supplier Part Number 2: 810-MLZ1608M4R7WT000; Part number IPS: N.A.; Part number Norautron: N.A.
L2 = L0201-2n7-HQ-Murata: Inductor, 600mA, ±0.1ｎH, 120mOhm; Manufacturer: Murata; Manufacturer Part Number: LQP03HQ2N7B02; Part number IPS: 00000001753; Part number NEMS: 100300214; Component Status: Active; Pad Count: 2; Note: -55°C ~ 125°C; Artikkelnr Noca: N.A.; Part Number: L0201-2n7-HQ-Murata; PartId: 100300214; Component Class: Inductors; Author: rsk; ComponentLink1URL: https://search.murata.co.jp/Ceramy/image/img/P02/JELF243C-0021.pdf; ComponentLink1Description: Datasheet; ComponentLink2URL: N.A.; ComponentLink2Description: Supplier link; HelpURL: https://psearch.en.murata.com/inductor/product/LQP03HQ2N7B02%23.html; LatestRevisionDate: 2018-10-23; Published: 2018-10-23; Footprint Doc: 0201; Value: 2.7nH; Supplier 1: Digi-Key; Supplier Part Number 1: 490-13909-1-ND; Supplier 2: N.A.; Supplier Part Number 2: N.A.; Part number Norautron: N.A.
L3 L4 = L0201-3n5-HQ-Murata: Inductor, 500mA, ±0.1ｎH, 170mOhm; Manufacturer: Murata; Manufacturer Part Number: LQP03HQ3N5B02; Part number NEMS: 100300222; Component Status: Active; Pad Count: 2; Note: -55°C ~ 125°C; Artikkelnr Noca: N.A.; Part Number: L0201-3n5-HQ-Murata; PartId: 100300222; Component Class: Inductors; Author: rsk; ComponentLink1URL: https://search.murata.co.jp/Ceramy/image/img/P02/JELF243C-0021.pdf; ComponentLink1Description: Datasheet; ComponentLink2URL: N.A.; ComponentLink2Description: Supplier link; HelpURL: https://psearch.en.murata.com/inductor/product/LQP03HQ3N5B02%23.html; LatestRevisionDate: 2018-10-23; Published: 2018-10-23; Footprint Doc: 0201; Value: 3.5nH; Supplier 1: Digi-Key; Supplier Part Number 1: 490-13925-1-ND; Supplier 2: N.A.; Supplier Part Number 2: N.A.; Part number IPS: N.A.; Part number Norautron: N.A.
P3 = Pin List 1x2: Pin List 1x2, 2.54mm (100mil); Manufacturer: N.A.; Part number NEMS: 100500297; Component Status: Active; Pad Count: 2; Artikkelnr Noca: 56019040; System: Connector; Part Number: Pin List 1x2; PartId: 100500297; Component Class: Connectors; Author: rsk; Manufacturer Part Number: N.A.; ComponentLink1URL: N.A.; ComponentLink1Description: Datasheet; ComponentLink2URL: N.A.; ComponentLink2Description: Supplier link; HelpURL: N.A.; LatestRevisionDate: 2009-12-12; Published: 2009-12-12; Footprint Doc: LIST_1x2; Value: Pin List 1x2; Note: N.A.; Supplier 1: N.A.; Supplier Part Number 1: N.A.; Supplier 2: N.A.; Supplier Part Number 2: N.A.; Part number IPS: N.A.; Part number Norautron: N.A.
P4 = Pin List 1x3: Pin List 1x3, 2.54mm (100mil); Manufacturer: N.A.; Part number NEMS: 100500304; Component Status: Active; Pad Count: 3; Artikkelnr Noca: 56019041; System: Connector; Part Number: Pin List 1x3; PartId: 100500304; Component Class: Connectors; Author: rsk; Manufacturer Part Number: N.A.; ComponentLink1URL: N.A.; ComponentLink1Description: Datasheet; ComponentLink2URL: N.A.; ComponentLink2Description: Supplier link; HelpURL: N.A.; LatestRevisionDate: 2009-12-12; Published: 2009-12-12; Footprint Doc: LIST_1x3; Value: Pin List 1x3; Note: N.A.; Supplier 1: N.A.; Supplier Part Number 1: N.A.; Supplier 2: N.A.; Supplier Part Number 2: N.A.; Part number IPS: N.A.; Part number Norautron: N.A.
R3 = R0201-0R: Resistor, ±5%, 0.05W; Manufacturer: N.A.; Part number IPS: 00000003245; Part number NEMS: 100100001; Component Status: Active; Pad Count: 2; Note: Chip Res 5%; Part Number: R0201-0R; PartId: 100100001; Component Class: Resistors; Author: rsk; Manufacturer Part Number: N.A.; ComponentLink1URL: N.A.; ComponentLink1Description: Datasheet; ComponentLink2URL: N.A.; ComponentLink2Description: Supplier link; HelpURL: N.A.; LatestRevisionDate: 2017-11-09; Published: 2014-11-13; Footprint Doc: 0201; Value: 0R; Supplier 1: N.A.; Supplier Part Number 1: N.A.; Supplier 2: N.A.; Supplier Part Number 2: N.A.; Artikkelnr Noca: N.A.; Part number Norautron: N.A.
R33 R34 = R0402-0R: Resistor, ±5%, 0.063W; Manufacturer: N.A.; Part number IPS: 00000007128; Part number NEMS: 100100109; Component Status: Active; Pad Count: 2; Note: Chip Res 5%; Artikkelnr Noca: 27049000; Part Number: R0402-0R; PartId: 100100109; Component Class: Resistors; Author: rsk; Manufacturer Part Number: N.A.; ComponentLink1URL: N.A.; ComponentLink1Description: Datasheet; ComponentLink2URL: N.A.; ComponentLink2Description: Supplier link; HelpURL: N.A.; LatestRevisionDate: 2009-11-23; Published: 2009-05-08; Footprint Doc: 0402; Value: 0R; Supplier 1: Farnell; Supplier Part Number 1: 146-9661; Supplier 2: N.A.; Supplier Part Number 2: N.A.; Part number Norautron: N.A.
SB3 SB4 = Solderbridge Shorted 0.4mm: Shorted Solderbridge; Manufacturer: N.A.; Part number NEMS: 100500561; Component Status: Active; Pad Count: 2; System: Connector; Part Number: Solderbridge Shorted 0.4mm; PartId: 100500561; Component Class: Connectors; Author: rsk; Manufacturer Part Number: N.A.; ComponentLink1URL: N.A.; ComponentLink1Description: Datasheet; ComponentLink2URL: N.A.; ComponentLink2Description: Supplier link; HelpURL: N.A.; LatestRevisionDate: 2012-08-07; Published: 2012-08-07; Footprint Doc: Solderbridge_Shorted; Value: Solderbridge; Note: N.A.; Supplier 1: N.A.; Supplier Part Number 1: N.A.; Supplier 2: N.A.; Supplier Part Number 2: N.A.; Artikkelnr Noca: N.A.; Part number IPS: N.A.; Part number Norautron: N.A.
SB5 SB6 = Solderbridge 0.4mm: Manufacturer: N.A.; Part number NEMS: 100500560; Component Status: Active; Pad Count: 2; System: Connector; Part Number: Solderbridge 0.4mm; PartId: 100500560; Component Class: Connectors; Author: rsk; Manufacturer Part Number: N.A.; ComponentLink1URL: N.A.; ComponentLink1Description: Datasheet; ComponentLink2URL: N.A.; ComponentLink2Description: Supplier link; HelpURL: N.A.; LatestRevisionDate: 2009-12-14; Published: 2009-12-14; Footprint Doc: Solderbridge; Value: Solderbridge; Note: N.A.; Supplier 1: N.A.; Supplier Part Number 1: N.A.; Supplier 2: N.A.; Supplier Part Number 2: N.A.; Artikkelnr Noca: N.A.; Part number IPS: N.A.; Part number Norautron: N.A.
TP1 TP2 = TP_SMD_Ø1.5MM: 1.5mm circular SMD testpad; Manufacturer: Nordic Semiconductor; Manufacturer Part Number: N.A.; Part number NEMS: 100500477; Pad Count: 1; Component Status: Active; Part Number: TP_SMD_Ø1.5MM; ComponentLink1URL: N.A.; ComponentLink1Description: Datasheet; ComponentLink2URL: N.A.; ComponentLink2Description: Supplier link; HelpURL: N.A.; Footprint Doc: TP_SMD_Ø1.5mm; LatestRevisionDate: 2021-03-05; Published: 2016-06-02; Value: Ø1.5mm,SMD; Note: N.A.; Supplier 1: N.A.; Supplier Part Number 1: N.A.; Supplier 2: N.A.; Supplier Part Number 2: N.A.; Artikkelnr Noca: N.A.; Part number IPS: N.A.; Component Class: Connectors; PartId: 100500477; Author: rsk; Part number Norautron: N.A.
U1 = nRF54L15-QFAAC00: Multi-protocol Bluetooth Low Energy, IEEE 802.15.4 and 2.4GHz proprietary Wireless MCU; Manufacturer: Nordic Semiconductor; Part number NEMS: 102000382; Component Status: Active; Pad Count: 49; Note: N.A.; Part Number: nRF54L15-QFAAC00; Component Class: Nordic_Devices; Author: stl1; Manufacturer Part Number: nRF54L15-QFAAC00; ComponentLink1URL: N.A.; ComponentLink1Description: Datasheet; ComponentLink2URL: N.A.; ComponentLink2Description: Supplier link; HelpURL: N.A.; LatestRevisionDate: 2025-01-30; Published: 2025-01-30; Footprint Doc: QFN-48; Value: nRF54L15-QFAA; Supplier 1: Nordic Semiconductor; Supplier Part Number 1: nRF54L15-QFAAC00; Supplier 2: N.A.; Supplier Part Number 2: N.A.; Artikkelnr Noca: N.A.; Part number IPS: N.A.; Part number Norautron: N.A.; PartId: 102000382
X1 = XTAL_SMD2012_32.768kHz_9pF_TXC: XTAL SMD 2012, 32.768kHz, 9pF, ±20ppm; Manufacturer: TXC Corporation; Manufacturer Part Number: 9HT11-32.768KDZC-T; Part number NEMS: 101600107; Component Status: Active; Pad Count: 2; Note: XTAL SMD 32.768kHz; Artikkelnr Noca: N.A.; Part Number: XTAL_SMD2012_32.768kHz_9pF_TXC; PartId: 101600107; Component Class: Oscillators; Author: eisk; ComponentLink1URL: http://www.txccrystal.com/images/pdf/9ht11.pdf; ComponentLink1Description: Datasheet; ComponentLink2URL: https://www.digikey.com/en/products/detail/9HT11-32.768KDZC-T/887-1426-1-ND/2403277; ComponentLink2Description: Supplier link; HelpURL: http://www.txccrystal.com/images/pdf/9ht11.pdf; LatestRevisionDate: 2023-03-14; Published: 2014-03-28; Footprint Doc: XTAL_2012; Value: 32.768kHz; Supplier 1: Digi-Key; Supplier Part Number 1: 887-1426-2-ND; Supplier 2: Mouser; Supplier Part Number 2: 717-9HT11-32.7KDZC-T; Part number IPS: N.A.; Part number Norautron: N.A.
X2 = XTAL_SMD2016_32MHz_8pF_Golledge: XTAL SMD 2016, 32MHz, Cl=8pF, Tol: ±10ppm, Stab: ±15ppm; Manufacturer Part Number: MP06003; Part number IPS: 00000001431; Part number Norautron: N.A.; Part number NEMS: 101600041; Component Status: Active; Pad Count: 4; Note: XTAL SMD 32.000MHz; Artikkelnr Noca: 22010050; Part Number: XTAL_SMD2016_32MHz_8pF_Golledge; PartId: 101600041; Component Class: Oscillators; Author: rsk; Manufacturer: Golledge; ComponentLink1URL: N.A.; ComponentLink1Description: Datasheet; ComponentLink2URL: N.A.; ComponentLink2Description: Supplier link; HelpURL: \\hizz\pro\app9717\Datasheet\crystals\Golledge\mp06003.pdf; LatestRevisionDate: 2016-11-02; Published: 2016-11-02; Footprint Doc: XTAL_2016; Value: 32MHz; Supplier 1: Link Nordic; Supplier Part Number 1: N.A.; Supplier 2: N.A.; Supplier Part Number 2: N.A.